# Altium schematic sheet RES_Controller.SchDoc
size A4
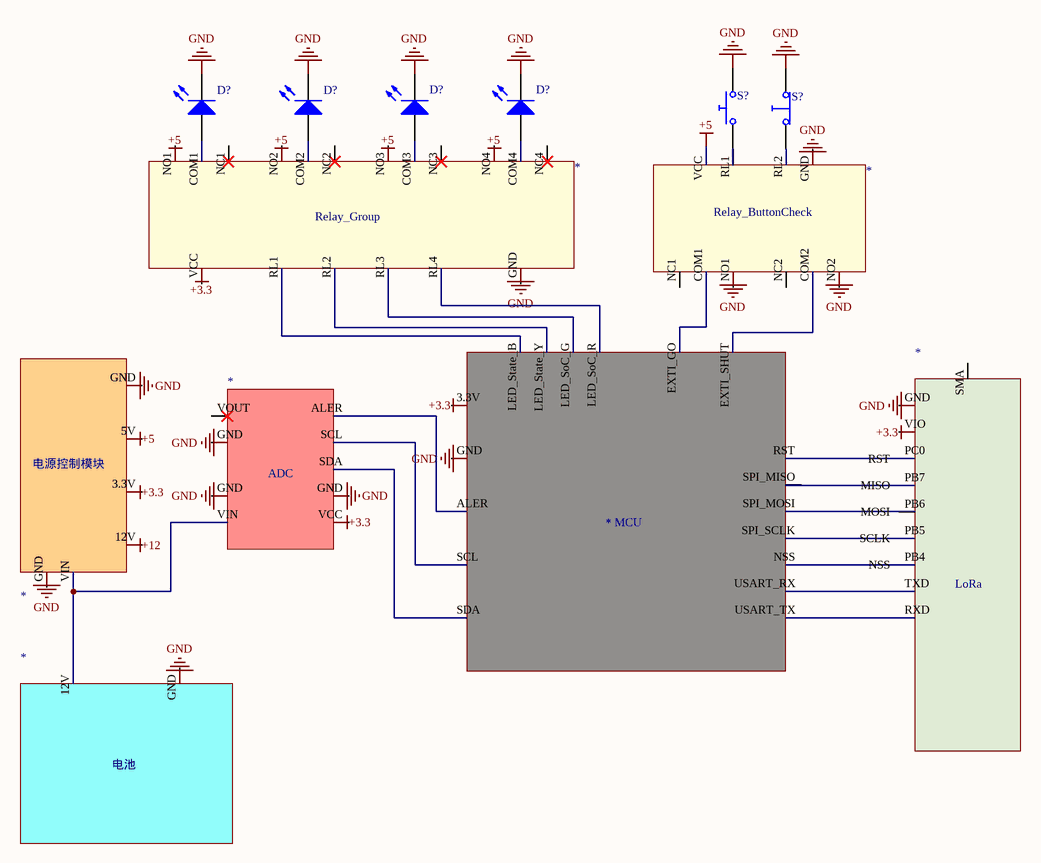
[diagram p0: RES_Controller.SchDoc]

## Parts
(Parts that share a designator on the sheet are numbered #1, #2 ... from top to bottom, then left to right.)
*#1  Relay_Group
*#2  Relay_ButtonCheck
*#3  ADC
*#4  电源控制模块
*#5  MCU
*#6  LoRa
*#7  电池
D?#1  Light-Emitting Diode  (value not drawn)
D?#2  Light-Emitting Diode  (value not drawn)
D?#3  Light-Emitting Diode  (value not drawn)
D?#4  Light-Emitting Diode  (value not drawn)
S?#1  Push Button Normally Opened  (value not drawn)
S?#2  Push Button Normally Closed  (value not drawn)

## Nets
+3.3: *#1.VCC *#3.VCC *#4.3.3V *#5.3.3V *#6.VIO
+5: *#1.NO1 *#1.NO2 *#1.NO3 *#1.NO4 *#2.VCC *#4.5V
+12: *#4.12V
GND: *#1.GND *#2.GND *#2.NO1 *#2.NO2 *#3.GND *#4.GND *#5.GND *#6.GND *#7.GND D?#1.2(K) D?#2.2(K) D?#3.2(K) D?#4.2(K) S?#1.2 S?#2.2
Net*#1_COM1: *#1.COM1 D?#3.1(A)
Net*#1_COM2: *#1.COM2 D?#4.1(A)
Net*#1_COM3: *#1.COM3 D?#1.1(A)
Net*#1_COM4: *#1.COM4 D?#2.1(A)
Net*#1_RL1: *#1.RL1 *#5.LED_State_B
Net*#1_RL2: *#1.RL2 *#5.LED_State_Y
Net*#1_RL3: *#1.RL3 *#5.LED_SoC_G
Net*#1_RL4: *#1.RL4 *#5.LED_SoC_R
Net*#2_COM1: *#2.COM1 *#5.EXTI_GO
Net*#2_COM2: *#2.COM2 *#5.EXTI_SHUT
Net*#2_RL1: *#2.RL1 S?#1.1
Net*#2_RL2: *#2.RL2 S?#2.1
Net*#3_ALER: *#3.ALER *#5.ALER
Net*#3_SCL: *#3.SCL *#5.SCL
Net*#3_SDA: *#3.SDA *#5.SDA
Net*#3_VIN: *#3.VIN *#4.VIN *#7.12V
Net*#5_NSS: *#5.NSS *#6.PB4(NSS)
Net*#5_RST: *#5.RST *#6.PC0(RST)
Net*#5_SPI_MISO: *#5.SPI_MISO *#6.PB7(MISO)
Net*#5_SPI_MOSI: *#5.SPI_MOSI *#6.PB6(MOSI)
Net*#5_SPI_SCLK: *#5.SPI_SCLK *#6.PB5(SCLK)
Net*#5_USART_RX: *#5.USART_RX *#6.TXD
Net*#5_USART_TX: *#5.USART_TX *#6.RXD

Not connected (* = marked no-connect by the designer): *#1 NC1* NC2* NC3* NC4*; *#2 NC1 NC2; *#3 VOUT*; *#6 SMA

## Library data of the parts
D?#1-D?#4 = LED: AF: 1; BV: 0; BV_MAX: 1e99; EG: 1.11; FC: 0.5; IBV: 0.001; IS: 1e-14; MJSW: 0.33; NTUN: 30; TNOM: 27; XTI: 3; SimulationGenericComponent: True; CJO: 0; CJP: 0; CTA: 0; CTP: 0; FCS: 0.5; FV_MAX: 1e99; IKF: 0; IKR: 0; ISR: 1e-14; JSW: 0; JTUN: 0; JTUNSW: 0; KEG: 1; KF: 0; LEVEL: 1; N: 1; NBV: 1; NR: 1; NS: 1; PHP: 1; RS: 0; TCV: 0; TLEV: 0; TLEVC: 0; TM1: 0; TM2: 0; TPB: 0; TPHP: 0; TRS: 0; TRS2: 0; TT: 0; TTT1: 0; TTT2: 0; VJ: 1; XTITUN: 3
S?#1 = Push Button NO: closed: 0; Rclosed: 1m; Ropen: 1Meg; SimulationGenericComponent: True
S?#2 = Push Button NC: closed: 1; Rclosed: 1m; Ropen: 1Meg; SimulationGenericComponent: True